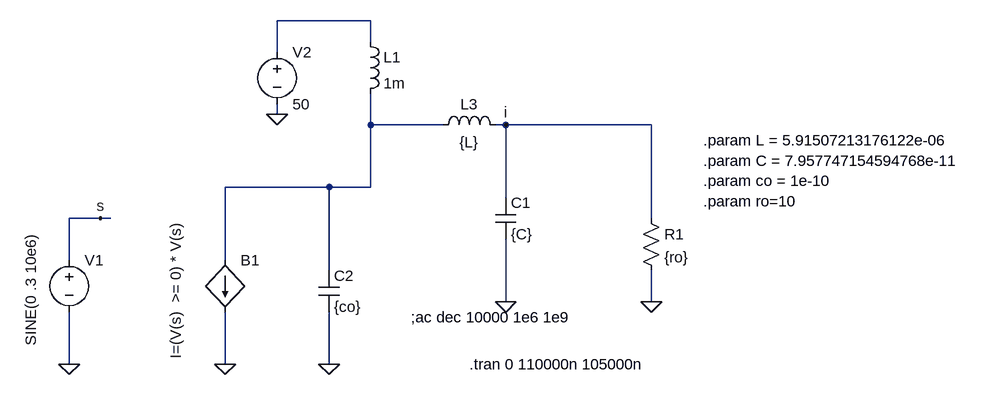
[diagram p0: schematic FiltroPI.asc]
FiltroPI.asc, the LTspice schematic file:
Version 4
SHEET 1 2088 680
WIRE -160 -128 -304 -128
WIRE -160 -96 -160 -128
WIRE -304 -80 -304 -128
WIRE -304 16 -304 0
WIRE -160 32 -160 -16
WIRE -48 32 -160 32
WIRE 48 32 32 32
WIRE 272 32 48 32
WIRE -224 128 -384 128
WIRE -160 128 -160 32
WIRE -160 128 -224 128
WIRE 48 144 48 32
WIRE -576 176 -624 176
WIRE -560 176 -576 176
WIRE 272 176 272 32
WIRE -624 240 -624 176
WIRE -384 240 -384 128
WIRE -224 256 -224 128
WIRE 48 304 48 208
WIRE 272 304 272 256
WIRE -624 400 -624 320
WIRE -384 400 -384 320
WIRE -224 400 -224 320
FLAG 272 304 0
FLAG 48 304 0
FLAG -384 400 0
FLAG 48 32 i
FLAG -624 400 0
FLAG -576 176 s
FLAG -304 16 0
FLAG -224 400 0
SYMBOL res 256 160 R0
SYMATTR InstName R1
SYMATTR Value {ro}
SYMBOL cap 32 144 R0
SYMATTR InstName C1
SYMATTR Value {C}
SYMBOL voltage -624 224 R0
WINDOW 3 -59 -25 VRight 2
WINDOW 123 0 0 Left 0
WINDOW 39 0 0 Left 0
SYMATTR InstName V1
SYMATTR Value SINE(0 .3 10e6)
SYMBOL voltage -304 -96 R0
WINDOW 123 0 0 Left 0
WINDOW 39 0 0 Left 0
SYMATTR InstName V2
SYMATTR Value 50
SYMBOL ind -64 48 R270
WINDOW 0 32 56 VTop 2
WINDOW 3 5 56 VBottom 2
SYMATTR InstName L3
SYMATTR Value {L}
SYMBOL ind -176 -112 R0
SYMATTR InstName L1
SYMATTR Value 1m
SYMBOL bi -384 240 R0
WINDOW 3 -76 153 VLeft 2
SYMATTR InstName B1
SYMATTR Value I=(V(s)  >= 0) * V(s)
SYMBOL cap -240 256 R0
SYMATTR InstName C2
SYMATTR Value {co}
TEXT -98 328 Left 2 !;ac dec 10000 1e6 1e9
TEXT -8 400 Left 2 !.tran 0 110000n 105000n
TEXT 352 56 Left 2 !.param L = 5.91507213176122e-06\n.param C = 7.957747154594768e-11\n.param co = 1e-10\n.param ro=10

The netlist it stands for:
* FiltroPI.asc
R1 i 0 {ro}
C1 i 0 {C}
V1 s 0 SINE(0 .3 10e6)
V2 N001 0 50
L3 N002 i {L}
L1 N001 N002 1m
B1 N002 0 I=(V(s)  >= 0) * V(s)
C2 N002 0 {co}
;ac dec 10000 1e6 1e9
.tran 0 110000n 105000n
.param L = 5.91507213176122e-06
.param C = 7.957747154594768e-11
.param co = 1e-10
.param ro=10
.backanno
.end